# EAGLE schematic TTTASK (EAGLE 9.6.2)
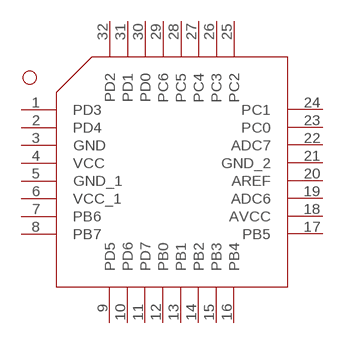
[diagram p0: schematic, sheet 1]

## Parts
U$1  ATM328P  [ATM328P]
Unconnected: U$1.1(PD3) U$1.2(PD4) U$1.3(GND) U$1.4(VCC) U$1.5(GND_1) U$1.6(VCC_1) U$1.7(PB6) U$1.8(PB7) U$1.9(PD5) U$1.10(PD6) U$1.11(PD7) U$1.12(PB0) U$1.13(PB1) U$1.14(PB2) U$1.15(PB3) U$1.16(PB4) U$1.17(PB5) U$1.18(AVCC) U$1.19(ADC6) U$1.20(AREF) U$1.21(GND_2) U$1.22(ADC7) U$1.23(PC0) U$1.24(PC1) U$1.25(PC2) U$1.26(PC3) U$1.27(PC4) U$1.28(PC5) U$1.29(PC6) U$1.30(PD0) U$1.31(PD1) U$1.32(PD2)

## Library data of the parts
U$1 = TQFP328P:ATM328P